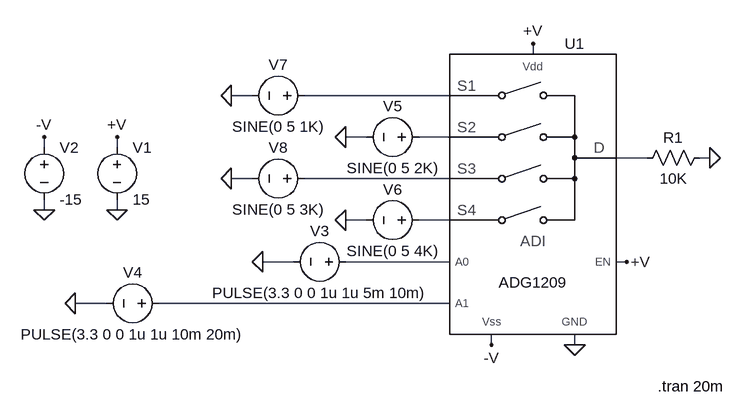
[diagram p0: schematic ADG1209.asc]
ADG1209.asc, the LTspice schematic file:
Version 4
SHEET 1 2844 1336
WIRE 784 -400 784 -416
WIRE 352 -336 320 -336
WIRE 656 -336 432 -336
WIRE 528 -272 496 -272
WIRE 656 -272 608 -272
WIRE 32 -256 32 -272
WIRE 144 -256 144 -272
WIRE 960 -240 912 -240
WIRE 1056 -240 1040 -240
WIRE 352 -208 320 -208
WIRE 656 -208 432 -208
WIRE 32 -160 32 -176
WIRE 144 -160 144 -176
WIRE 528 -144 496 -144
WIRE 656 -144 608 -144
WIRE 416 -80 368 -80
WIRE 656 -80 496 -80
WIRE 928 -80 912 -80
WIRE 128 -16 80 -16
WIRE 656 -16 208 -16
WIRE 720 48 720 32
WIRE 848 48 848 32
FLAG 32 -160 0
FLAG 144 -160 0
FLAG 144 -272 +V
FLAG 32 -272 -V
FLAG 720 48 -V
FLAG 784 -416 +V
FLAG 848 48 0
FLAG 368 -80 0
FLAG 1056 -240 0
FLAG 80 -16 0
FLAG 496 -272 0
FLAG 496 -144 0
FLAG 320 -336 0
FLAG 320 -208 0
FLAG 928 -80 +V
SYMBOL voltage 144 -272 R0
WINDOW 123 0 0 Left 0
WINDOW 39 0 0 Left 0
SYMATTR InstName V1
SYMATTR Value 15
SYMBOL voltage 32 -272 R0
WINDOW 123 0 0 Left 0
WINDOW 39 0 0 Left 0
SYMATTR InstName V2
SYMATTR Value -15
SYMBOL voltage 512 -80 R90
WINDOW 0 -32 56 VBottom 2
WINDOW 3 32 56 VTop 2
WINDOW 123 0 0 Left 0
WINDOW 39 0 0 Left 0
SYMATTR InstName V3
SYMATTR Value PULSE(3.3 0 0 1u 1u 5m 10m)
SYMBOL res 944 -224 R270
WINDOW 0 32 56 VTop 2
WINDOW 3 0 56 VBottom 2
SYMATTR InstName R1
SYMATTR Value 10K
SYMBOL voltage 224 -16 R90
WINDOW 0 -32 56 VBottom 2
WINDOW 3 32 56 VTop 2
WINDOW 123 0 0 Left 0
WINDOW 39 0 0 Left 0
SYMATTR InstName V4
SYMATTR Value PULSE(3.3 0 0 1u 1u 10m 20m)
SYMBOL voltage 624 -272 R90
WINDOW 0 -32 56 VBottom 2
WINDOW 3 32 56 VTop 2
WINDOW 123 0 0 Left 0
WINDOW 39 0 0 Left 0
SYMATTR InstName V5
SYMATTR Value SINE(0 5 2K)
SYMBOL voltage 624 -144 R90
WINDOW 0 -32 56 VBottom 2
WINDOW 3 32 56 VTop 2
WINDOW 123 0 0 Left 0
WINDOW 39 0 0 Left 0
SYMATTR InstName V6
SYMATTR Value SINE(0 5 4K)
SYMBOL voltage 448 -336 R90
WINDOW 0 -32 56 VBottom 2
WINDOW 3 32 56 VTop 2
WINDOW 123 0 0 Left 0
WINDOW 39 0 0 Left 0
SYMATTR InstName V7
SYMATTR Value SINE(0 5 1K)
SYMBOL voltage 448 -208 R90
WINDOW 0 -32 56 VBottom 2
WINDOW 3 32 56 VTop 2
WINDOW 123 0 0 Left 0
WINDOW 39 0 0 Left 0
SYMATTR InstName V8
SYMATTR Value SINE(0 5 3K)
SYMBOL ADG1209 784 -80 R0
SYMATTR InstName U1
TEXT 976 112 Left 2 !.tran 20m

The netlist it stands for:
* ADG1209.asc
V1 +V 0 15
V2 -V 0 -15
V3 N006 0 PULSE(3.3 0 0 1u 1u 5m 10m)
R1 N003 0 10K
V4 N007 0 PULSE(3.3 0 0 1u 1u 10m 20m)
V5 N002 0 SINE(0 5 2K)
V6 N005 0 SINE(0 5 4K)
V7 N001 0 SINE(0 5 1K)
V8 N004 0 SINE(0 5 3K)
XU1 N006 +V -V N001 N002 N004 N005 N003 +V 0 N007 ADG1209  ; pins A0 EN Vss S1 S2 S3 S4 D Vdd GND A1
.tran 20m
.lib ADG1209.sub
.backanno
.end